# EAGLE design trapezoid (EAGLE 7.6.0)
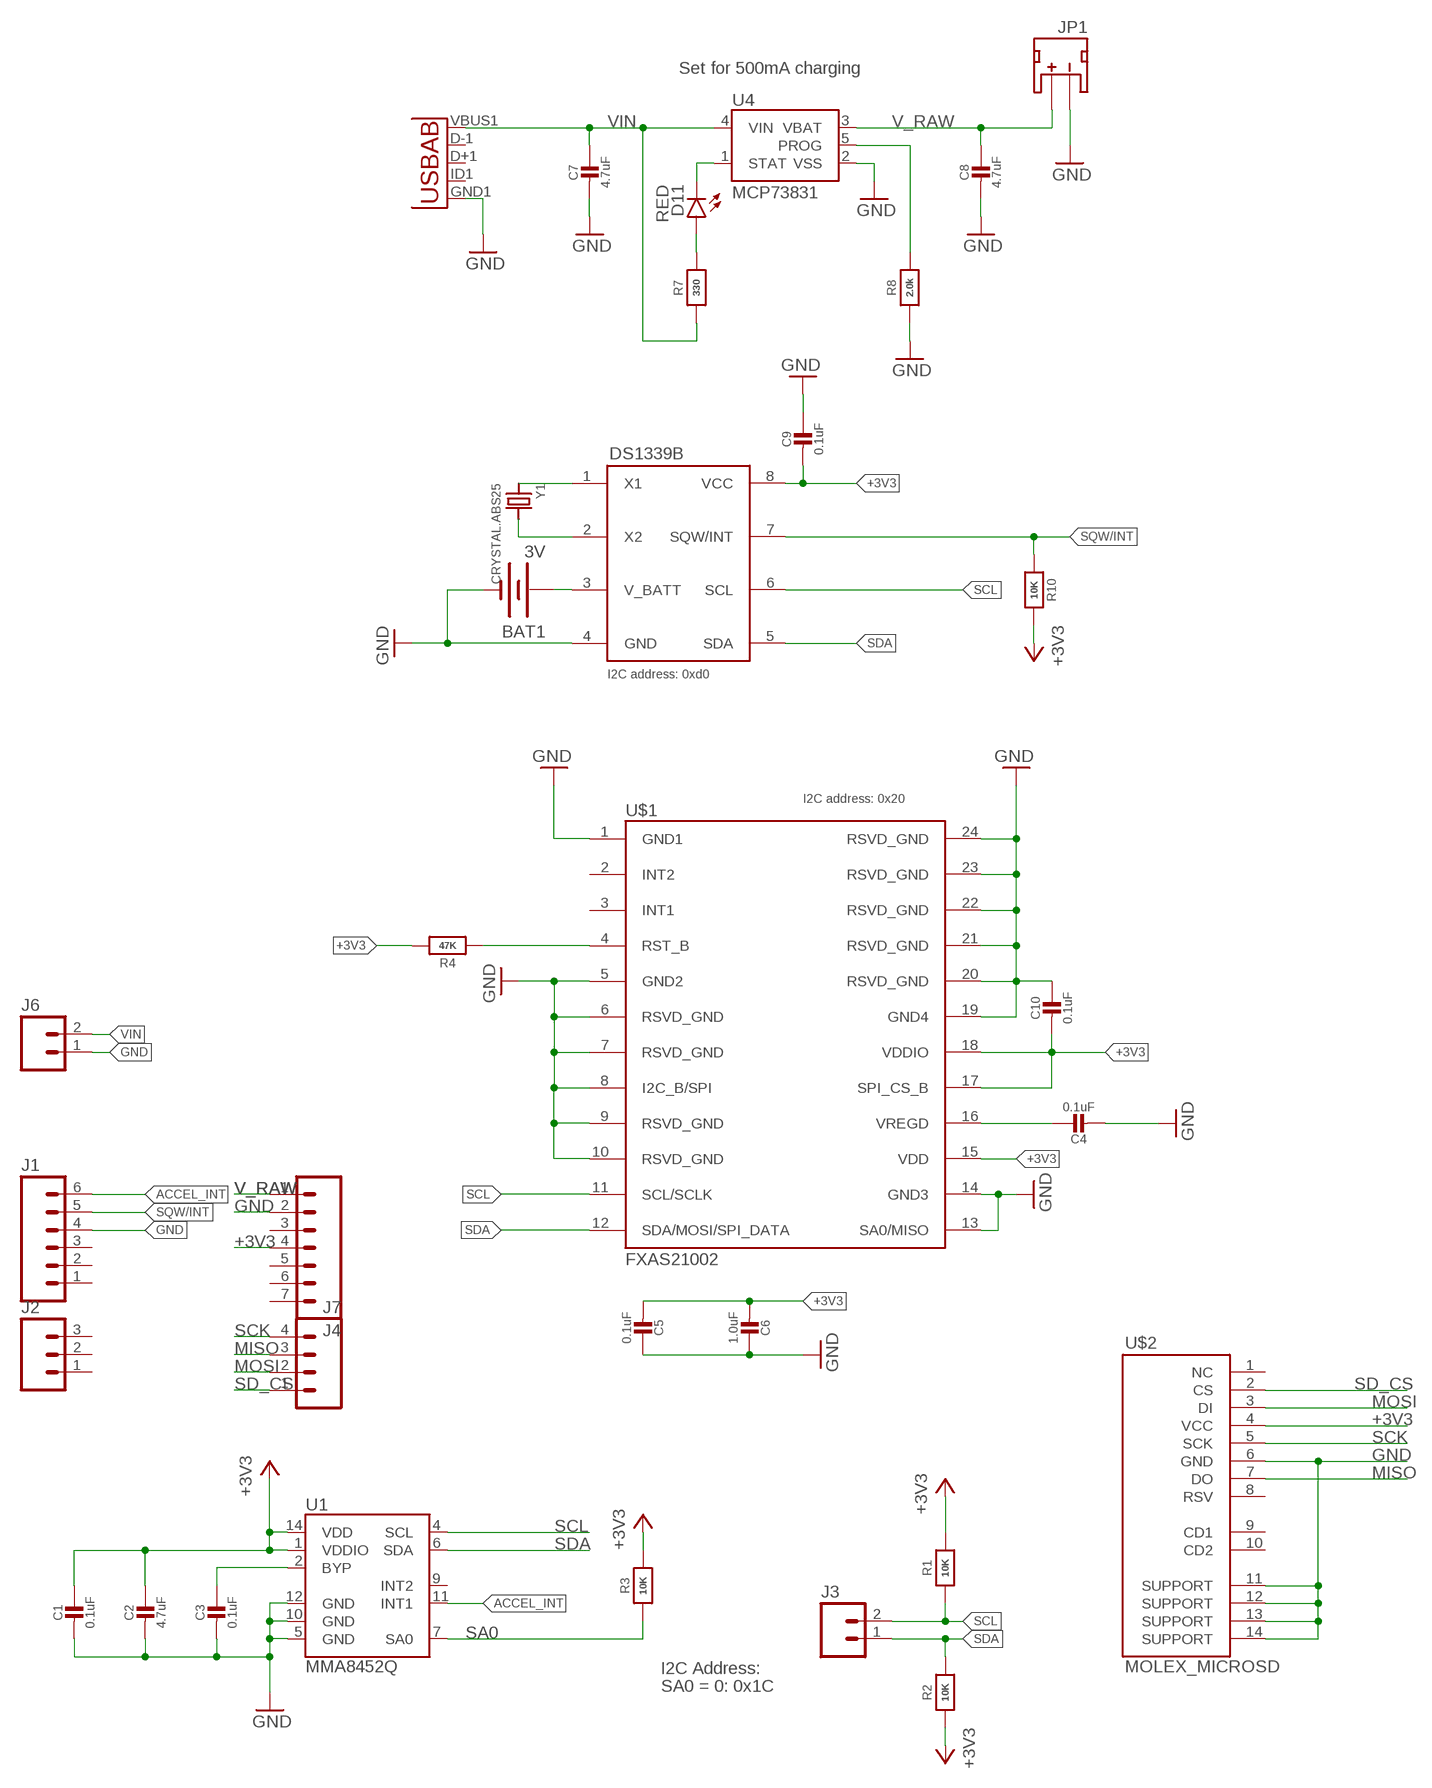
[diagram p0: schematic, sheet 1]

## Parts
BAT1  3V  BATTERY  [BATTCON_12MM_CURVED]
C1  0.1uF  CAP_CERAMIC0805-NOOUTLINE  [0805-NO]
C2  4.7uF  CAP_CERAMIC0805-NOOUTLINE  [0805-NO]
C3  0.1uF  CAP_CERAMIC0805-NOOUTLINE  [0805-NO]
C4  0.1uF  CAP_CERAMIC0805-NOOUTLINE  [0805-NO]
C5  0.1uF  CAP_CERAMIC0805-NOOUTLINE  [0805-NO]
C6  1.0uF  CAP_CERAMIC0805-NOOUTLINE  [0805-NO]
C7  4.7uF  CAP_CERAMIC0805-NOOUTLINE  [0805-NO]
C8  4.7uF  CAP_CERAMIC0805-NOOUTLINE  [0805-NO]
C9  0.1uF  CAP_CERAMIC0805-NOOUTLINE  [0805-NO]
C10  0.1uF  CAP_CERAMIC0805-NOOUTLINE  [0805-NO]
D11  RED  LED-RED0603  [LED-0603]
J1  M06SILK_FEMALE_PTH  [1X06]
J2  M03PTH  [1X03]
J3  M02LOCK  [1X02_LOCK]
J4  M07  [1X07]
J6  M02LOCK  [1X02_LOCK]
J7  M04PTH  [1X04]
JP1  JST  JST_2MM_MALE  [JST-2-SMD@1]
JP9  Micro USB  USB-ABCONN-11794  [USB-AB-MICRO-SMD_V03]
R1  10K  RESISTOR0805_NOOUTLINE  [0805-NO]
R2  10K  RESISTOR0805_NOOUTLINE  [0805-NO]
R3  10K  RESISTOR_0805MP  [_0805MP]
R4  47K  RESISTOR0805_NOOUTLINE  [0805-NO]
R7  330  RESISTOR_0805MP  [_0805MP]
R8  2.0k  RESISTOR_0805MP  [_0805MP]
R10  10K  RESISTOR0805_NOOUTLINE  [0805-NO]
U1  MMA8452Q  [QFN-16_0.5MM]
U4  MCP73831  [SOT23-5]
U$1  FXAS21002  [24QFN]
U$2  MOLEX_MICROSD  [MOLEX_MICROSD]
U$3  DS1339BDS1339B  [8U-SOP]
Y1  CRYSTAL.ABS25  [ABS25]

## Nets
+3V3: C1.1 C2.1 C5.2 C6.2 C9.2 C10.2 J4.4 R1.2 R2.1 R3.2 R4.2 R10.2 U1.1(VDDIO) U1.14(VDD) U$1.15(VDD) U$1.17(SPI_CS_B) U$1.18(VDDIO) U$2.4(VCC) U$3.8(VCC)
ACCEL_INT: J1.6 U1.11(INT1)
BYP: C3.1 U1.2(BYP)
GND: BAT1.GND(-) C1.2 C2.2 C3.2 C4.2 C5.1 C6.1 C7.2 C8.2 C9.1 C10.1 J1.4 J4.2 J6.1 JP1.1(-) JP9.GND1(GND) R8.1 U1.5(GND) U1.10(GND) U1.12(GND) U4.2(VSS) U$1.1(GND1) U$1.5(GND2) U$1.6(RSVD_GND) U$1.7(RSVD_GND) U$1.8(I2C_B/SPI) U$1.9(RSVD_GND) U$1.10(RSVD_GND) U$1.13(SA0/MISO) U$1.14(GND3) U$1.19(GND4) U$1.20(RSVD_GND) U$1.21(RSVD_GND) U$1.22(RSVD_GND) U$1.23(RSVD_GND) U$1.24(RSVD_GND) U$2.6(GND) U$2.11(SUPPORT) U$2.12(SUPPORT) U$2.13(SUPPORT) U$2.14(SUPPORT) U$3.4(GND)
MISO: J7.3 U$2.7(DO)
MOSI: J7.2 U$2.3(DI)
N$1: D11.A R7.2
N$2: U$3.2(X2) Y1.4
N$3: C4.1 U$1.16(VREGD)
N$4: BAT1.PWR@1(+) U$3.3(V_BATT)
N$5: U$3.1(X1) Y1.1
N$9: R4.1 U$1.4(RST_B)
PROG: R8.2 U4.5(PROG)
SA0: R3.1 U1.7(SA0)
SCK: J7.4 U$2.5(SCK)
SCL: J3.2 R1.1 U1.4(SCL) U$1.11(SCL/SCLK) U$3.6(SCL)
SD_CS: J7.1 U$2.2(CS)
SDA: J3.1 R2.2 U1.6(SDA) U$1.12(SDA/MOSI/SPI_DATA) U$3.5(SDA)
SQW/INT: J1.5 R10.1 U$3.7(SQW/INT)
STAT: D11.C U4.1(STAT)
V_RAW: C8.1 J4.1 JP1.2(+) U4.3(VBAT)
VIN: C7.1 J6.2 JP9.VBUS1(VBUS) R7.1 U4.4(VIN)
Unconnected: J1.1 J1.2 J1.3 J2.1 J2.2 J2.3 J4.3 J4.5 J4.6 J4.7 JP1.NC1(PAD1) JP1.NC2(PAD2) JP9.D+1(D+) JP9.D-1(D-) JP9.ID1(USBID) U1.9(INT2) U$1.2(INT2) U$1.3(INT1) U$2.1(NC) U$2.8(RSV) U$2.9(CD1) U$2.10(CD2)

## Notes on the sheet
- Set for 500mA charging
- I2C address: 0xd0
- I2C address: 0x20
- I2C Address:
- SA0 = 0: 0x1C

## Library data of the parts
BAT1 = SparkFun:BATTERY: Battery Holders Various common sizes : AA, AAA, 20mm coin cell and 12mm coin cell.
C1-C10 = microbuilder:CAP_CERAMIC: Ceramic Capacitors For new designs, use the packages preceded by an '_' character since they are more reliable: The following footprints should be used on most boards: _0402 - Standard footprint for regular board layouts _0603 - Standard footprint for regular board layouts _0805 - Standard footprint for regular board layouts _1206 - Standard footprint for regular board layouts For extremely tight-pitch boards where space is at a premium, the following 'micro-pitch' footprints can be used (smaller pads, no silkscreen outline, etc.): _0402MP - Micro-pitch footprint for very dense/compact boards _0603MP - Micro-pitch footprint for very dense/compact boards _0805MP - Micro-pitch footprint for very dense/compact boards _1206MP - Micro-pitch footprint for very dense/compact boards
D11 = SparkFun-LED:LED-RED: Assorted Red LEDs LilyPad 1206- DIO-09912 1206- DIO-00809 0603- DIO-00819; PROD_ID: DIO-00819
J1 = SparkFun-Connectors:M06: Header 6 Standard 6-pin 0.1" header. Use with straight break away headers (SKU : PRT-00116), right angle break away headers (PRT-00553), swiss pins (PRT-00743), machine pins (PRT-00117), and female headers (PRT-00115). Molex polarized connector foot print use with SKU : PRT-08094 with associated crimp pins and housings. NOTES ON THE VARIANTS LOCK and LOCK_LONGPADS... This footprint was designed to help hold the alignment of a through-hole component (i.e. 6-pin header) while soldering it into place. You may notice that each hole has been shifted either up or down by 0.005 of an inch from it's more standard position (which is a perfectly straight line). This slight alteration caused the pins (the squares in the middle) to touch the edges of the holes. Because they are alternating, it causes a "brace" to hold the component in place. 0.005 has proven to be the perfect amount of "off-center" position when using our standard breakaway headers. Although looks a little odd when you look at the bare footprint, once you have a header in there, the alteration is very hard to notice. Also,if you push a header all the way into place, it is covered up entirely on the bottom side. This idea of altering the position of holes to aid alignment will be further integrated into the Sparkfun Library for other footprints. It can help hold any component with 3 or more connection pins.; PROD_ID: CONN-08437
J2 = SparkFun-Connectors:M03: Header 3 Standard 3-pin 0.1" header. Use with straight break away headers (SKU : PRT-00116), right angle break away headers (PRT-00553), swiss pins (PRT-00743), machine pins (PRT-00117), and female headers (PRT-00115). Molex polarized connector foot print use with SKU : PRT-08232 with associated crimp pins and housings.
J3 J6 = SparkFun-Connectors:M02: Standard 2-pin 0.1" header. Use with - straight break away headers ( PRT-00116) - right angle break away headers (PRT-00553) - swiss pins (PRT-00743) - machine pins (PRT-00117) - female headers (PRT-00115) Molex polarized connector foot print use with: PRT-08233 with associated crimp pins and housings. 2.54_SCREWTERM for use with PRT-10571. 3.5mm Screw Terminal footprints for PRT-08084 5mm Screw Terminal footprints for use with PRT-08432
J4 = SparkFun-Connectors:M07: Header 7 Standard 7-pin 0.1" header. Use with straight break away headers (SKU : PRT-00116), right angle break away headers (PRT-00553), swiss pins (PRT-00743), machine pins (PRT-00117), and female headers (PRT-00115). NOTES ON THE VARIANTS LOCK and LOCK_LONGPADS... This footprint was designed to help hold the alignment of a through-hole component (i.e. 7-pin header) while soldering it into place. You may notice that each hole has been shifted either up or down by 0.005 of an inch from it's more standard position (which is usually a perfectly straight line). This slight alteration caused the pins (the squares in the middle) to touch the edges of the holes. Because they are alternating, it causes a "brace" to hold the header in place. 0.005 has proven to be the perfect amount of "off-center" position when using our standard breakaway headers. Although looks a little odd when you look at the bare footprint, once you have a header in there, the alteration is very hard to notice. Also, if you push a header all the way into place, it is covered up entirely on the bottom side. This idea of altering the position of holes to aid alignment will be further integrated into the Sparkfun Library for other footprints. It can help hold any component with 3 or more connection pins.
J7 = SparkFun-Connectors:M04: Header 4 Standard 4-pin 0.1" header. Use with straight break away headers (SKU : PRT-00116), right angle break away headers (PRT-00553), swiss pins (PRT-00743), machine pins (PRT-00117), and female headers (PRT-00115). Molex polarized connector foot print use with SKU : PRT-08231 with associated crimp pins and housings. 1MM SMD Version SKU: PRT-10208; PROD_ID: CONN-09696
JP1 = SparkFun-Connectors:JST_2MM_MALE: Mates to single-cell LiPo batteries. CONN-08352; PROD_ID: CONN-08352
JP9 = SparkFun-Connectors:USB-AB: This is a USB AB connector that is compatible with USB OTG. i.e. this connector can serve as a host or device; PROD_ID: CONN-11794
R1-R4 R7 R8 R10 = microbuilder:RESISTOR: Resistors For new designs, use the packages preceded by an '_' character since they are more reliable: The following footprints should be used on most boards: _0402 - Standard footprint for regular board layouts _0603 - Standard footprint for regular board layouts _0805 - Standard footprint for regular board layouts _1206 - Standard footprint for regular board layouts For extremely tight-pitch boards where space is at a premium, the following 'micro-pitch' footprints can be used (smaller pads, no silkscreen outline, etc.): _0402MP - Micro-pitch footprint for very dense/compact boards _0603MP - Micro-pitch footprint for very dense/compact boards _0805MP - Micro-pitch footprint for very dense/compact boards _1206MP - Micro-pitch footprint for very dense/compact boards
U1 = SparkFun:MMA8452Q: MMA8452Q 3-Axis, 12/8-bit Digital Accelerometer Supply Voltage: 1.6-3.6V Range: +/- 2g, 4g, 8g Interface: I2C, 12-bit and 8-bit ODR: 1.56 Hz - 800 Hz Package: QFN-16 http://cache.freescale.com/files/sensors/doc/data_sheet/MMA8452Q.pdf
U4 = SparkFun-PowerIC:MCP73831: Miniature single cell, fully integrated Li-Ion, Li-polymer charge management controller http://ww1.microchip.com/downloads/en/DeviceDoc/21984a.pdf IC-09995; PROD_ID: IC-09995
U$1 = sharkdunio:FXAS21002: FXAS21002 I2C/SPI low power gyro
U$2 = sharkdunio:MOLEX_MICROSD: molex 1040310811 uSD slot
U$3 = sharkdunio:DS1339B: DS1339B RTC
Y1 = abracon:CRYSTAL

## Board
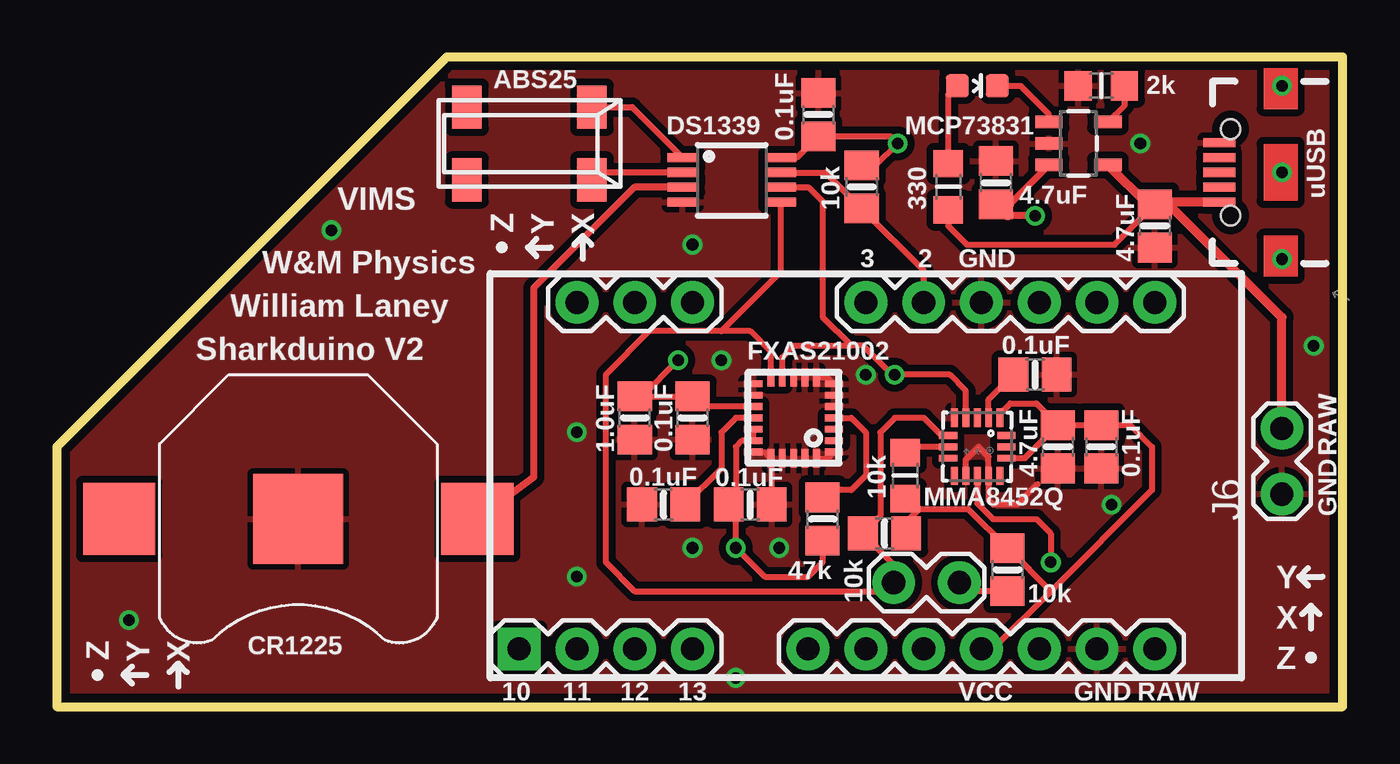
[diagram p1: board, top side]
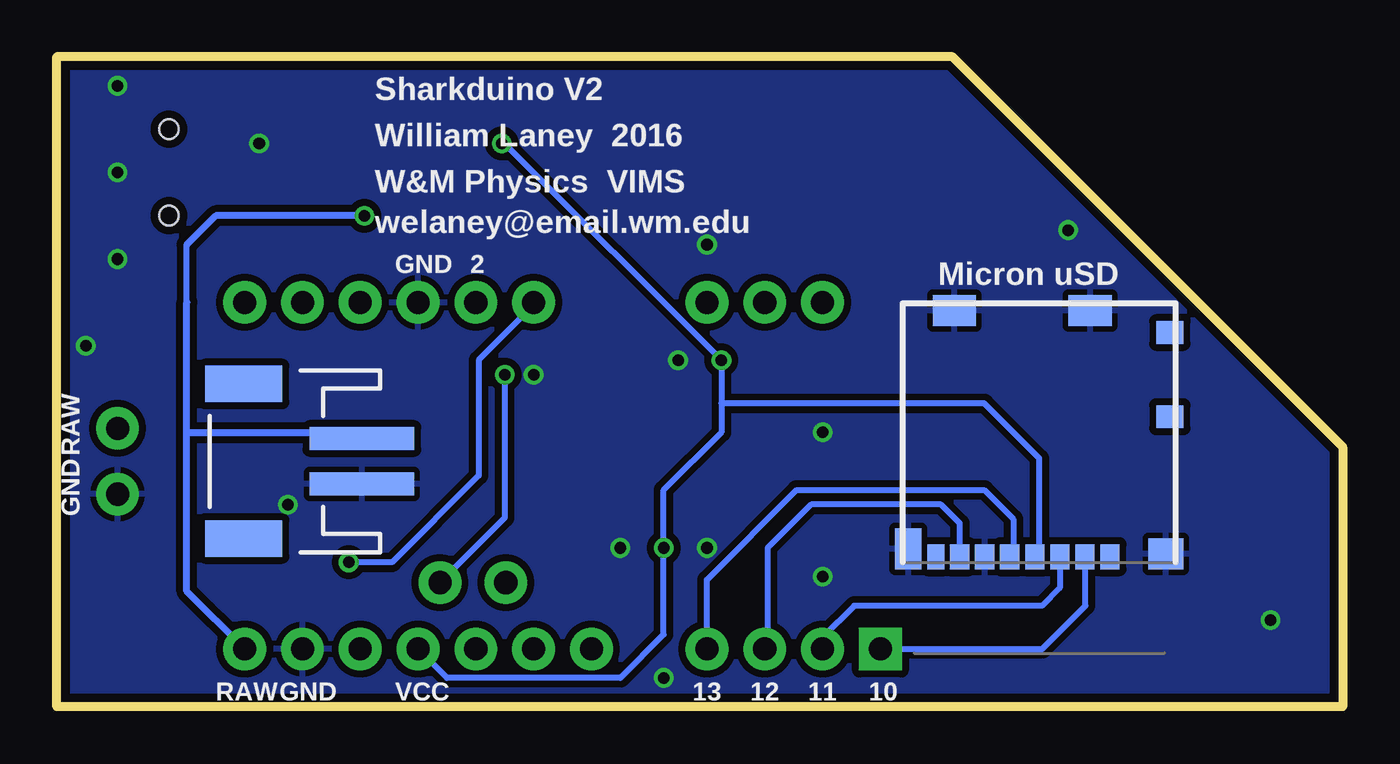
[diagram p2: board, bottom side, seen from below]

Size 56.52 x 28.57 mm. Coordinates in mm from the lower left corner, seen from the top.
Outline: 0,0 56.52,0 56.52,28.57 17.14,28.57 0,11.43 0,0
Copper layers (1*16): Top 0.0356mm / dielectric 1.5011mm / Bottom 0.0356mm
Design rules "oshpark-2layer": minimum track width 6mil, minimum drill 13mil, track to track 6mil, track to pad 6mil, pad to pad 6mil, via to via 6mil, smd to smd 6mil, copper to edge 15mil, drill to drill 6mil, minimum pad ring 7mil, minimum via ring 7mil, stop-mask expansion 2.5mil, vias tented up to drill 0mil, thermal gap 10mil

### Footprints (pad centres in the part's own frame; a part is rotated, then mirrored left to right if it is on the bottom)
BATTCON_12MM_CURVED = smd 3.962 x 3.962: GND 0,0 | smd 3.175 x 3.175: PWR@1 -7.874,0; PWR@2 7.874,0
0805-NO = smd 1.3 x 1.5: 1 -0.95,0; 2 0.95,0
LED-0603 = smd 1 x 1: A 0,-0.877; C 0,0.877
1X06 = drill 1.016 pad 1.88: 1 0,0; 2 2.54,0; 3 5.08,0; 4 7.62,0; 5 10.16,0; 6 12.7,0
1X03 = drill 1.016 pad 1.88: 1 0,0; 2 2.54,0; 3 5.08,0
1X02_LOCK = drill 1.016 pad 1.88: 1 -0.178,0; 2 2.718,0
1X07 = drill 1.016 pad 1.88: 1 0,0; 2 2.54,0; 3 5.08,0; 4 7.62,0; 5 10.16,0; 6 12.7,0; 7 15.24,0
1X04 = drill 1.016 pad 1.88 square: 1 0,0 | drill 1.016 pad 1.88: 2 2.54,0; 3 5.08,0; 4 7.62,0
JST-2-SMD@1 = smd 1 x 4.6: 1 -1,-3.7; 2 1,-3.7 | smd 1.6 x 3.4: NC1 -3.4,1.5; NC2 3.4,1.5
USB-AB-MICRO-SMD_V03 = smd 1.4 x 0.4: D+1 2.7,0; D-1 2.7,0.65; GND1 2.7,-1.3; ID1 2.7,-0.65; VBUS1 2.7,1.3 | hole 0.85: 2.2,1.9; 2.2,-1.9
_0805MP = smd 1.2 x 1.3: 1 -1.016,0; 2 1.016,0
QFN-16_0.5MM = smd 0.8 x 0.3: 1 -1.275,1; 2 -1.275,0.5; 3 -1.275,0; 4 -1.275,-0.5; 5 -1.275,-1; 9 1.275,-1; 10 1.275,-0.5; 11 1.275,0; 12 1.275,0.5; 13 1.275,1 | smd 0.3 x 0.8: 6 -0.5,-1.275; 7 0,-1.275; 8 0.5,-1.275; 14 0.5,1.275; 15 0,1.275; 16 -0.5,1.275
SOT23-5 = smd 0.55 x 1.2: 1 -0.95,-1.3; 2 0,-1.3; 3 0.95,-1.3; 4 0.95,1.3; 5 -0.95,1.3
24QFN = smd 0.8 x 0.3: 1 -1.775,1.5; 2 -1.775,1; 3 -1.775,0.5; 4 -1.775,0; 5 -1.775,-0.5; 6 -1.775,-1; 7 -1.775,-1.5; 13 1.775,-1.5; 14 1.775,-1; 15 1.775,-0.5; 16 1.775,0; 17 1.775,0.5; 18 1.775,1; 19 1.775,1.5 | smd 0.3 x 0.8: 8 -1,-1.775; 9 -0.5,-1.775; 10 0,-1.775; 11 0.5,-1.775; 12 1,-1.775; 20 1,1.775; 21 0.5,1.775; 22 0,1.775; 23 -0.5,1.775; 24 -1,1.775
MOLEX_MICROSD = smd 0.85 x 1.1: 1 3.105,0.25; 2 2.005,0.25; 3 0.905,0.25; 4 -0.195,0.25; 5 -1.295,0.25; 6 -2.395,0.25; 7 -3.495,0.25 | smd 0.75 x 1.1: 8 -4.545,0.25 | smd 1.2 x 1: 9 5.74,6.4; 10 5.74,10.1 | smd 1.9 x 1.35: 11 2.24,11.075; 12 -3.73,11.075 | smd 1.17 x 1.8: 13 -5.755,0.6 | smd 1.55 x 1.35: 14 5.565,0.375
8U-SOP = smd 1.35 x 0.4: 1 -2.15,0.65; 2 -2.15,0; 3 -2.15,-0.65; 4 -2.15,-1.3; 5 2.15,-1.3; 6 2.15,-0.65; 7 2.15,0; 8 2.15,0.65
ABS25 = smd 1.3 x 1.9: 1 -2.75,-1.6; 2 2.75,-1.6; 3 2.75,1.6; 4 -2.75,1.6

### Placement (x,y rotation side)
BAT1  10.61,8.26 180 top
C1  45.9,11.43 270 top
C2  44,11.43 270 top
C3  42.99,14.61 0 top
C4  26.67,8.89 180 top
C5  27.94,12.7 90 top
C6  25.4,12.7 90 top
C7  48.26,21.14 270 top
C8  41.27,23.05 90 top
C9  33.47,26.04 270 top
C10  30.48,8.89 180 top
D11  40.45,27.3 270 top
J1  48.26,17.78 180 top
J2  22.86,17.78 0 top
J3  36.96,5.46 0 top
J4  48.26,2.54 180 top
J6  53.85,9.53 90 top
J7  20.32,2.54 0 top
JP1  46.8,10.79 90 bottom
JP9  53.79,23.5 180 top
R1  41.78,6.03 90 top
R2  36.38,7.62 180 top
R3  37.28,10.16 270 top
R4  33.65,8.26 270 top
R7  39.18,22.86 90 top
R8  45.9,27.3 0 top
R10  35.38,22.86 90 top
U1  40.45,11.43 270 top
U4  44.9,24.77 270 top
U$1  32.38,12.7 180 top
U$2  13.33,6.35 0 bottom
U$3  29.66,23.5 0 top
Y1  20.77,24.77 180 top

### Tracks (layer width: path | path; a pad name or v marks a point on that pad's centre or on a via)
+3V3  (via drill 0.51)
  Top 0.254: U$3.8 32.53,24.14 C9.2 36.64,25.09 v36.96,24.77 36.01,23.81 R10.2 | 41.27,7.49 R1.2 | R2.1 37.46,7.75 37.46,8.26 37.91,8.71 | R3.2 37.91,8.71 | U1.1 41.45,12.88 41.91,13.34 43.04,13.34 C2.1 | 37.91,8.71 40.05,8.71 | U$1.17 U$1.18 30.12,11.7 29.85,11.43 29.85,9.21 C10.2 29.85,8.57 v29.85,6.99 31.12,5.71 33.02,5.71 33.65,6.35 R4.2 | 27.76,13.2 C5.2 | C5.2 C6.2 25.71,13.65 v27.3,15.24 | U$1.15 28.39,13.2 C5.2 | U1.14 42.55,10.93 C2.1 | C2.1 C1.1 47.18,12.38 48.13,11.43 48.13,9.53 43.69,5.08 | 40.05,8.71 R1.2 | 40.05,8.71 40.06,8.71 | J4.4 41.15,2.54 43.69,5.08 | R1.2 43.69,5.08
  Bottom 0.254: J4.4 39.37,1.27 31.75,1.27 29.85,3.17 v29.85,6.99 29.85,9.53 27.3,12.06 27.3,13.34 | 27.3,13.34 v27.3,15.24 36.83,24.77 v36.96,24.77 | U$2.4 13.33,6.79 13.33,10.92 15.75,13.34 27.3,13.34
ACCEL_INT  (via drill 0.51)
  Top 0.254: v43.69,6.35 43.69,7.62 43.05,8.26 41.15,8.26 40.45,8.95 U1.11
  Bottom 0.254: J1.6 35.56,17.65 37.97,15.24 37.97,10.16 41.78,6.35 v43.69,6.35
BYP
  Top 0.254: U1.2 40.95,13.52 C3.1
GND  (via drill 0.51)
  Top 0.254: U$1.19 31.11,11.2 U$1.20 31.43,10.88 C10.1 | U$1.24 33.88,10.93 U$1.1 | U$1.8 33.88,14.47 U$1.7 | JP1.1 42.2,8.89 41.15,8.89 40.95,9.08 U1.12 40.95,10.99 40.51,11.43 39.95,10.87 U1.10
  other vias: 3.17,3.81 47.62,24.77 31.75,6.99 46.35,8.89 35.56,14.61 27.94,20.32 12.06,20.95 22.86,5.71 55.24,15.88 29.21,15.24 27.94,6.99 29.85,1.27 22.86,12.06 53.85,27.3 53.85,23.5 53.85,19.68
  pour Top (isolate 0.305): 0,0 56.52,0 56.52,28.57 17.14,28.57 0,11.43
  pour Bottom (isolate 0.305): 0,0 56.52,0 56.52,28.57 17.14,28.57 0,11.43
MISO
  Bottom 0.254: U$2.7 16.83,8.07 17.65,8.89 23.37,8.89 25.27,6.99 25.27,2.67 J7.3
MOSI
  Bottom 0.254: J7.2 22.86,3.05 21.46,4.45 13.21,4.45 12.43,5.22 U$2.3
N$1
  Top 0.254: 39.82,27.06 D11.A 39.18,26.91 R7.2
N$2
  Top 0.254: U$3.2 23.85,23.5 Y1.4
N$3
  Top 0.254: C4.1 29.21,10.48 29.21,12.06 29.85,12.7 U$1.16
N$4
  Top 0.305: U$3.3 25.39,22.84 20.96,18.41 20.96,10.09 BAT1.PWR@1
N$5
  Top 0.254: Y1.1 25.29,26.36 U$3.1
N$9
  Top 0.254: U$1.4 34.92,12.7 35.56,12.06 35.56,10.16 34.92,9.53 33.97,9.53 R4.1
PROG
  Top 0.254: R8.2 46.92,26.44 U4.5
SA0
  Top 0.254: U1.7 37.53,11.43 R3.1
SCK
  Bottom 0.254: U$2.5 14.48,6.75 14.48,8.26 15.75,9.53 24,9.53 27.94,5.59 J7.4
SCL  (via drill 0.51)
  Top 0.254: 40,12.71 U1.4 39.95,13.89 39.24,14.61 v36.83,14.61 36.7,14.61 35.43,15.88 34.92,15.88 | U$3.6 33.03,22.84 33.65,22.23 33.65,17.14 34.92,15.88 | 34.92,15.88 32.38,15.88 31.89,15.38 U$1.11 | R1.1 40.06,5.08 J3.2
  Bottom 0.254: J3.2 36.83,8.31 v36.83,14.61
SD_CS
  Bottom 0.254: 11.43,6.5 U$2.2 11.3,6.57 11.3,4.45 13.21,2.54 J7.1
SDA
  Top 0.254: U1.6 38.87,11.93 38.1,12.7 36.83,12.7 36.2,12.06 36.2,8.38 R2.2 36.78,6.27 J3.1 36.4,5.08 25.4,5.08 24.13,6.35 24.13,14.61 26.04,16.51 29.21,16.51 | U$3.5 31.81,19.11 29.21,16.51 | U$1.12 31.39,15.61 30.48,16.51 29.21,16.51
SQW/INT
  Top 0.254: 35.27,21.8 R10.1 | U$3.7 33.79,23.5 R10.1 | R10.1 35.88,21.91 | J1.5 38.1,19.18 R10.1
STAT
  Top 0.254: D11.C 42.36,27.3 43.6,26.07 U4.1
V_RAW  (via drill 0.51)
  Top 0.305: v42.99,21.59 41.78,21.59 | 41.88,22.09 U4.3
  Top 0.406: 41.78,21.59 C8.1 41.88,22.09
  Bottom 0.254: 43.38,12.06 JP1.2 | 50.8,17.78 50.8,20.32
  Bottom 0.305: v42.99,21.59 49.53,21.59 50.8,20.32 | 50.8,12.06 43.38,12.06 | J4.1 50.8,5.08 50.8,12.06 | 50.8,12.06 50.8,17.78
VIN
  Top 0.254: U4.4 46.67,23.82 | 48.26,22.2 C7.1 | C7.1 47.92,22.09 | R7.1 39.18,21.14 40,20.32 46.49,20.32 C7.1 | 48.36,22.2 C7.1
  Top 0.406: 47.92,22.09 U4.4 | JP9.VBUS1 48.77,22.2 | 48.77,22.2 48.36,22.2 | J6.2 53.85,17.11 48.77,22.2

### Text on the board
tPlace: ABS25 | 2k | DS1339 | 0.1uF | MCP73831 | VIMS | Z | Y | X | 10k | 330 | 4.7uF | uUSB | 4.7uF | W&M Physics | 3 | 2 | GND | William Laney | Sharkduino V2 | FXAS21002 | 0.1uF | 1.0uF | 0.1uF | RAW | RAW | 0.1uF | 0.1uF | 4.7uF | 0.1uF | 10k | MMA8452Q | GND | 47k | 10k | 10k | Y | Z | Y | X | X | CR1225 | Z | 10 | 11 | 12 | 13 | VCC | VCC | GND | RAW
bPlace: Sharkduino V2 | William Laney 2016 | W&M Physics VIMS | welaney@email.wm.edu | Micron uSD | 2 | GND | RAW | GND | 10 | 11 | 12 | 13 | VCC | GND | RAW